# Altium schematic sheet 08-USB_OTG.SchDoc
size A4
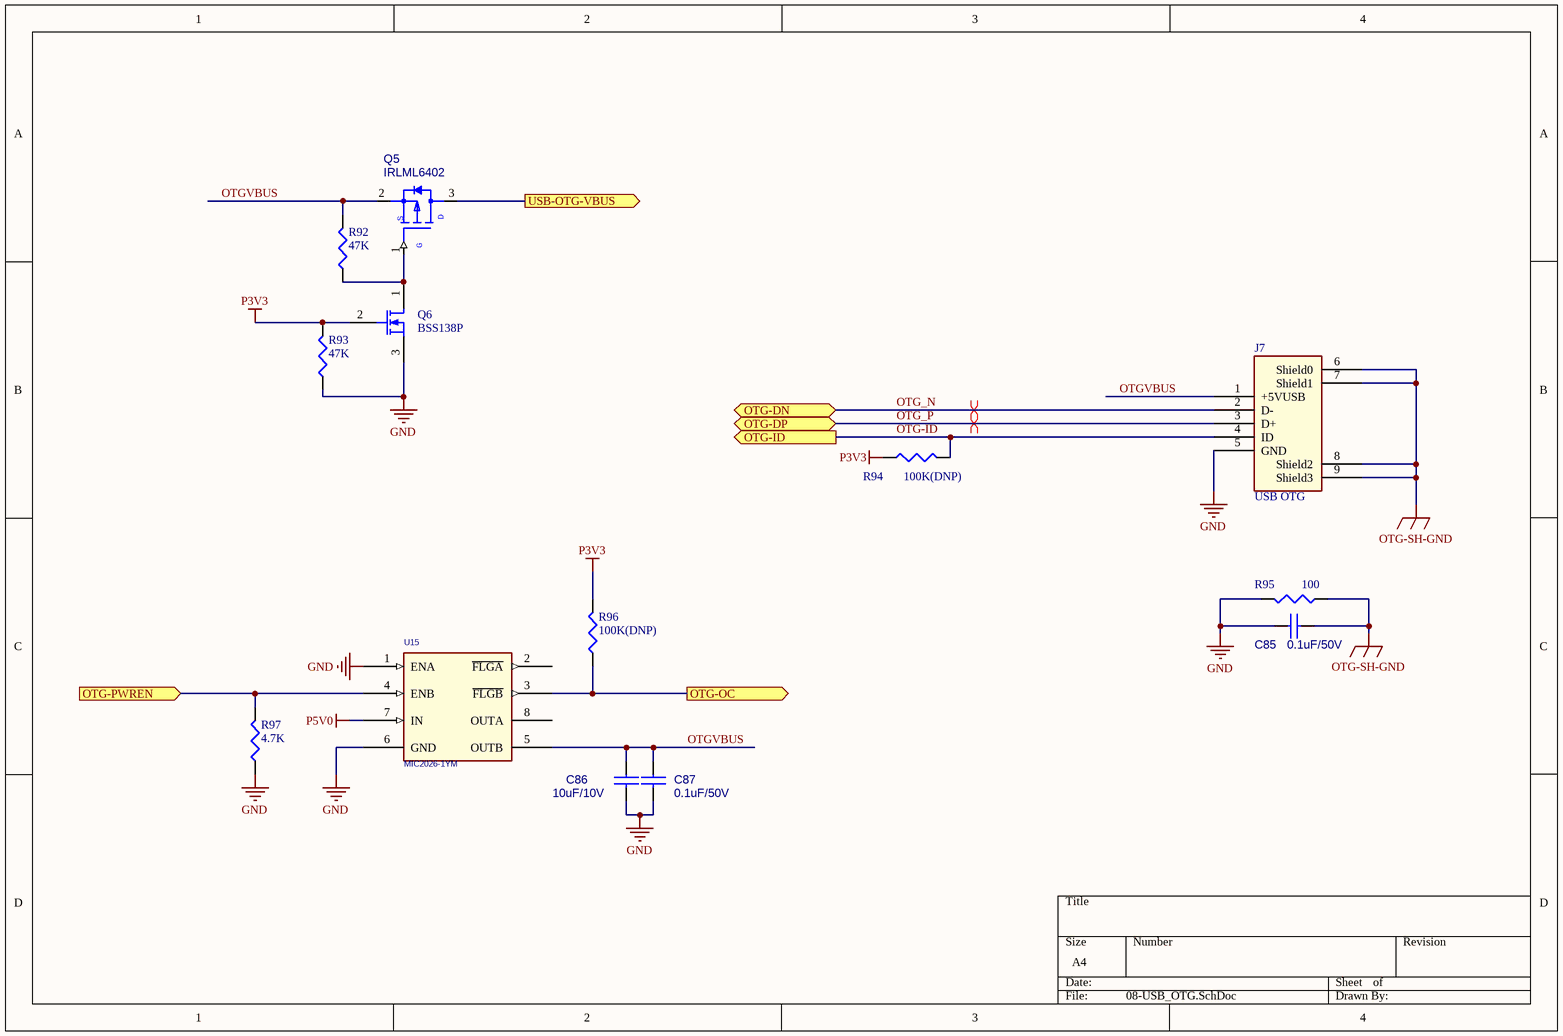
[diagram p0: 08-USB_OTG.SchDoc]

## Parts
C85  0.1uF/50V  [0402]
C86  10uF/10V  [0805]
C87  0.1uF/50V  [0402]
J7  USB OTG  [MINIUSB-TYPEAB]
Q5  IRLML6402  [MOSFET]
Q6  BSS138P  [NPN]
R92  47K  [0402]
R93  47K  [0402]
R94  100K(DNP)  [0402]
R95  100  [0402]
R96  100K(DNP)  [0402]
R97  4.7K  [0402]
U15  MIC2026-1YM  [SO8]

## Ports
OTG-DN, OTG-DP (bidir), OTG-ID (out), OTG-OC (out), OTG-PWREN (in), USB-OTG-VBUS (out)

## Nets
GND: C85.1 C86.2 C87.2 J7.5(GND) Q6.3(S) R93.1 R95.2 R97.1 U15.1(ENA) U15.6(GND)
OTG-SH-GND: C85.2 J7.6(Shield0) J7.7(Shield1) J7.8(Shield2) J7.9(Shield3) R95.1
P3V3: Q6.2(G) R93.2 R94.1 R96.2
P5V0: U15.7(IN)
OTG-ID: J7.4(ID) R94.2 ; port OTG-ID
OTG-OC: R96.1 U15.3(~{FLGB}) ; port OTG-OC
OTG-PWREN: R97.2 U15.4(ENB) ; port OTG-PWREN
OTG_N: J7.2(D-) ; port OTG-DN
OTG_P: J7.3(D+) ; port OTG-DP
OTGVBUS: C86.1 C87.1 J7.1(+5VUSB) Q5.2(S) R92.2 U15.5(OUTB)
USB-OTG-VBUS: Q5.3(D) ; port USB-OTG-VBUS
NetQ5_1: Q5.1(G) Q6.1(D) R92.1

Not connected (* = marked no-connect by the designer): U15 2(~{FLGA}) 8(OUTA)

## Layout directives
differential pair: OTG_N, OTG_P

## Library data of the parts
C85-C87 = CAP_Dup1
J7 = FOX_UH51543-JS7: Part Number: SP063100800; NC: 10,11; ROOM: USB
Q5 = AO3401L_SOT23-3_0: Part Number: SB934010010; ROOM: USB POWER; Part Value: AO3401L_SOT23-3
Q6 = MOSFET-N: N-Channel MOSFET; Published: 8-Jun-2000; LatestRevisionDate: 17-Jul-2002; LatestRevisionNote: Re-released for DXP Platform.; PackageVersion: 1995/1996; PackageReference: E3; Publisher: Altium Limited; PackageDescription: TO, Flat Index; 3 In-Line, Axial Leads; Body Dia. 4.6mm; Lead Dia. 0.5 mm (max)
R92-R97 = CR16-1003FM
U15 = MIC2526_8P: IC LIN SW PWR ACTIVE HIGH DUAL 2.7V-5.5V 0.5A SOIC8; CAD_APPROVED: Yes; MFG_NAME01: MICREL; AGILE_PN: 312-75936; CLASS: IC; HEIGHT: 1.73mm; ROHS: Yes; MFG_PN01: MIC2026-1YM